# Altium schematic sheet 4_TB6612（1）.schdoc.schdoc
size 309 x 223 mm; Symbol: Sheet-Symbol_A4; Device: Sheet-Symbol_A4; Company: 嘉立创EDA; Drawed: 吴登珂; Version: V1.0; Page Size: A4; @Project Name: TB6612; @Page Count: 4; @Update Date: 2024-04-14; @Create Date: 2024-04-10; @Schematic Name: Schematic1; @Page No: 1; @Page Name: TB6612（1）
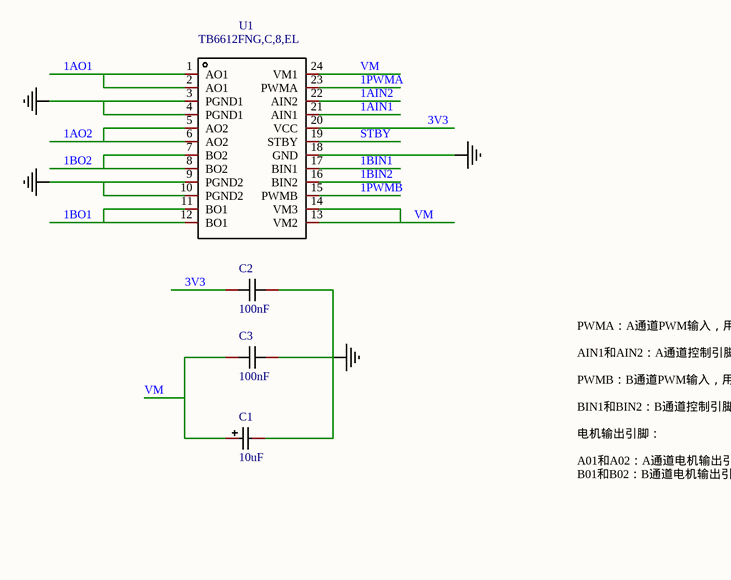
[diagram p0: 4_TB6612（1）.schdoc.schdoc]

## Parts
C1  10uF  [CAP-SMD_L3.5-W2.8-R-RD]
C2  100nF  [C0603]
C3  100nF  [C0603]
U1  TB6612FNG,C,8,EL  [SSOP-24_L8.3-W5.6-P0.65-LS7.6-BL]

## Nets
NetC1_2: C1.2 C2.2 C3.2 U1.3(PGND1) U1.4(PGND1) U1.9(PGND2) U1.10(PGND2) U1.18(GND)
1AIN1: U1.21(AIN1)
1AIN2: U1.22(AIN2)
1AO1: U1.1(AO1) U1.2(AO1)
1AO2: U1.5(AO2) U1.6(AO2)
1BIN1: U1.17(BIN1)
1BIN2: U1.16(BIN2)
1BO1: U1.11(BO1) U1.12(BO1)
1BO2: U1.7(BO2) U1.8(BO2)
1PWMA: U1.23(PWMA)
1PWMB: U1.15(PWMB)
3V3: C2.1 U1.20(VCC)
STBY: U1.19(STBY)
VM: C1.1 C3.1 U1.13(VM2) U1.14(VM3) U1.24(VM1)

## Notes on the sheet
- PWMA：A通道PWM输入，用于控制A通道电机的速度。
  AIN1和AIN2：A通道控制引脚，用于控制A通道电机的方向。
  PWMB：B通道PWM输入，用于控制B通道电机的速度。
  BIN1和BIN2：B通道控制引脚，用于控制B通道电机的方向。
- 电机输出引脚：
  A01和A02：A通道电机输出引脚。
  B01和B02：B通道电机输出引脚。
- 1
- 2
- 3
- 4
- 5
- 6
- A
- B
- C
- 原理图
- Schematic1
- 创建日期
- 更新日期
- 2024-04-14
- 2024-04-10
- 审阅
- 绘制
- 图页
- 吴登珂
- TB6612（1）
- 物料编码
- TB6612
- D
- 版本
- 尺寸
- 页
- 共
- V1.0
- A4
- 嘉立创EDA

## Library data of the parts
C1 = TAJB106K025RNJ: Manufacturer: Kyocera AVX; Add into BOM: yes; Tolerance: ±10%; Rated Voltage: 25V; Equivalent Series Resistance(ESR): 2.5Ω@100kHz; Description: 容值:10uF;精度:±10%;额定电压:25V;等效串联电阻:2.5Ω@100kHz;; Name: 10uF; Symbol: TAJB106K025RNJ; Device: TAJB106K025RNJ; LCSC Part Name: 10uF ±10% 25V; Supplier Part: C7194; Manufacturer Part: TAJB106K025RNJ; Supplier Footprint: CASE-B-3528; JLCPCB Part Class: 扩展库; Datasheet: https://atta.szlcsc.com/upload/public/pdf/source/20160107/1457707750344.pdf; Supplier: LCSC; Convert to PCB: yes; Value: 10uF; Operating Temperature: -55℃~+125℃
C2 C3 = CAP_0603: Symbol: CapAcitance; Convert to PCB: yes; Name: 100nF; Device: CAP_0603; Add into BOM: yes; Supplier Footprint: 0603; Value: 100nF
U1 = TB6612FNG,C,8,EL: Manufacturer: TOSHIBA(东芝); Add into BOM: yes; Drive motor type: 有刷直流电机; Supply Voltage: 2.7V~5.5V; Output Current: 1A; Interface: 并行; Description: 驱动电机类型:有刷直流电机;电源电压:2.7V~5.5V;输出电流:1A;接口:并行;; Name: TB6612FNG,C,8,EL; Symbol: TB6612FNG,C,8,EL; Device: TB6612FNG,C,8,EL; LCSC Part Name: 1A 有刷直流电机驱动芯片 5.5V; Supplier Part: C141517; Manufacturer Part: TB6612FNG,C,8,EL; Supplier Footprint: SSOP-24; JLCPCB Part Class: 扩展库; Datasheet: https://atta.szlcsc.com/upload/public/pdf/source/20171128/C141517_15118625624231147036.pdf; Supplier: LCSC; Convert to PCB: yes; Operating Temperature: -20℃~+85℃@(Ta)